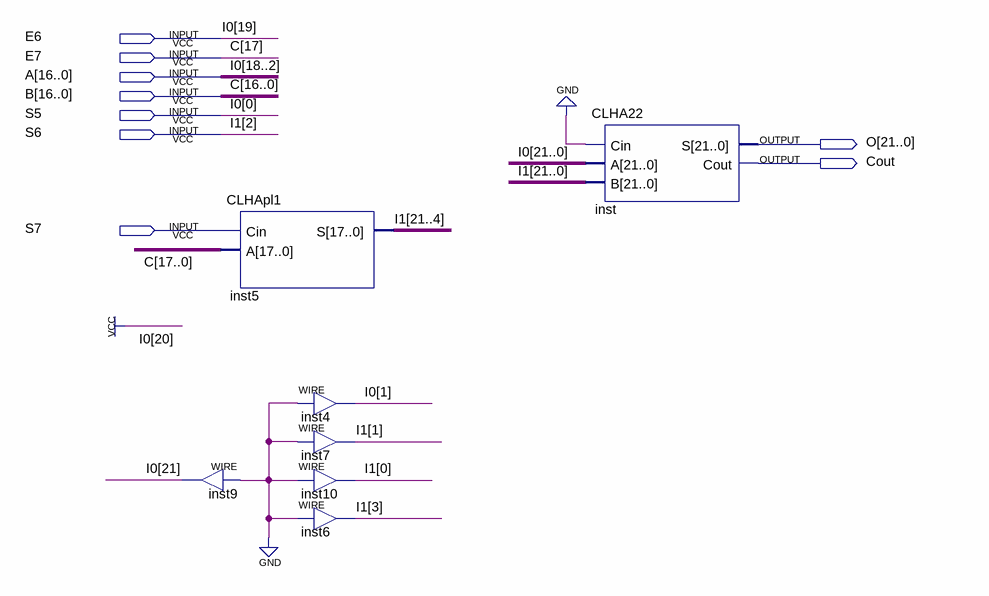
[diagram p0: schematic sheet]
// Quartus schematic R67.bdf as structural Verilog: 7 symbols, 9 pins
module R67 (
  input  E6,
  input  E7,
  input  [16:0] A,
  input  [16:0] B,
  input  S5,
  input  S6,
  input  S7,
  output [21:0] O,
  output Cout
);

  wire [21:0] I1;
  wire [21:1] I0;

  assign I0[21] = 1'b0;  // WIRE inst9
  CLHApl1 inst5 (.Cin(S7), .A({E7, B}), .S(I1[21:4]));
  assign I0[1] = 1'b0;  // WIRE inst4
  assign I1[1] = 1'b0;  // WIRE inst7
  assign I1[0] = 1'b0;  // WIRE inst10
  assign I1[3] = 1'b0;  // WIRE inst6
  CLHA22 inst (.Cin(1'b0), .A({I0[21], 1'b1, E6, A, I0[1], S5}), .B({I1[21:3], S6, I1[1:0]}), .S(O), .Cout(Cout));

  // Other names for the same wires on the sheet: C[17:0] = {E7, B}; I0 (some bits) = {E6, A, S5}; I1[2] = S6
endmodule
